# Altium project 遥控器.PrjPcb
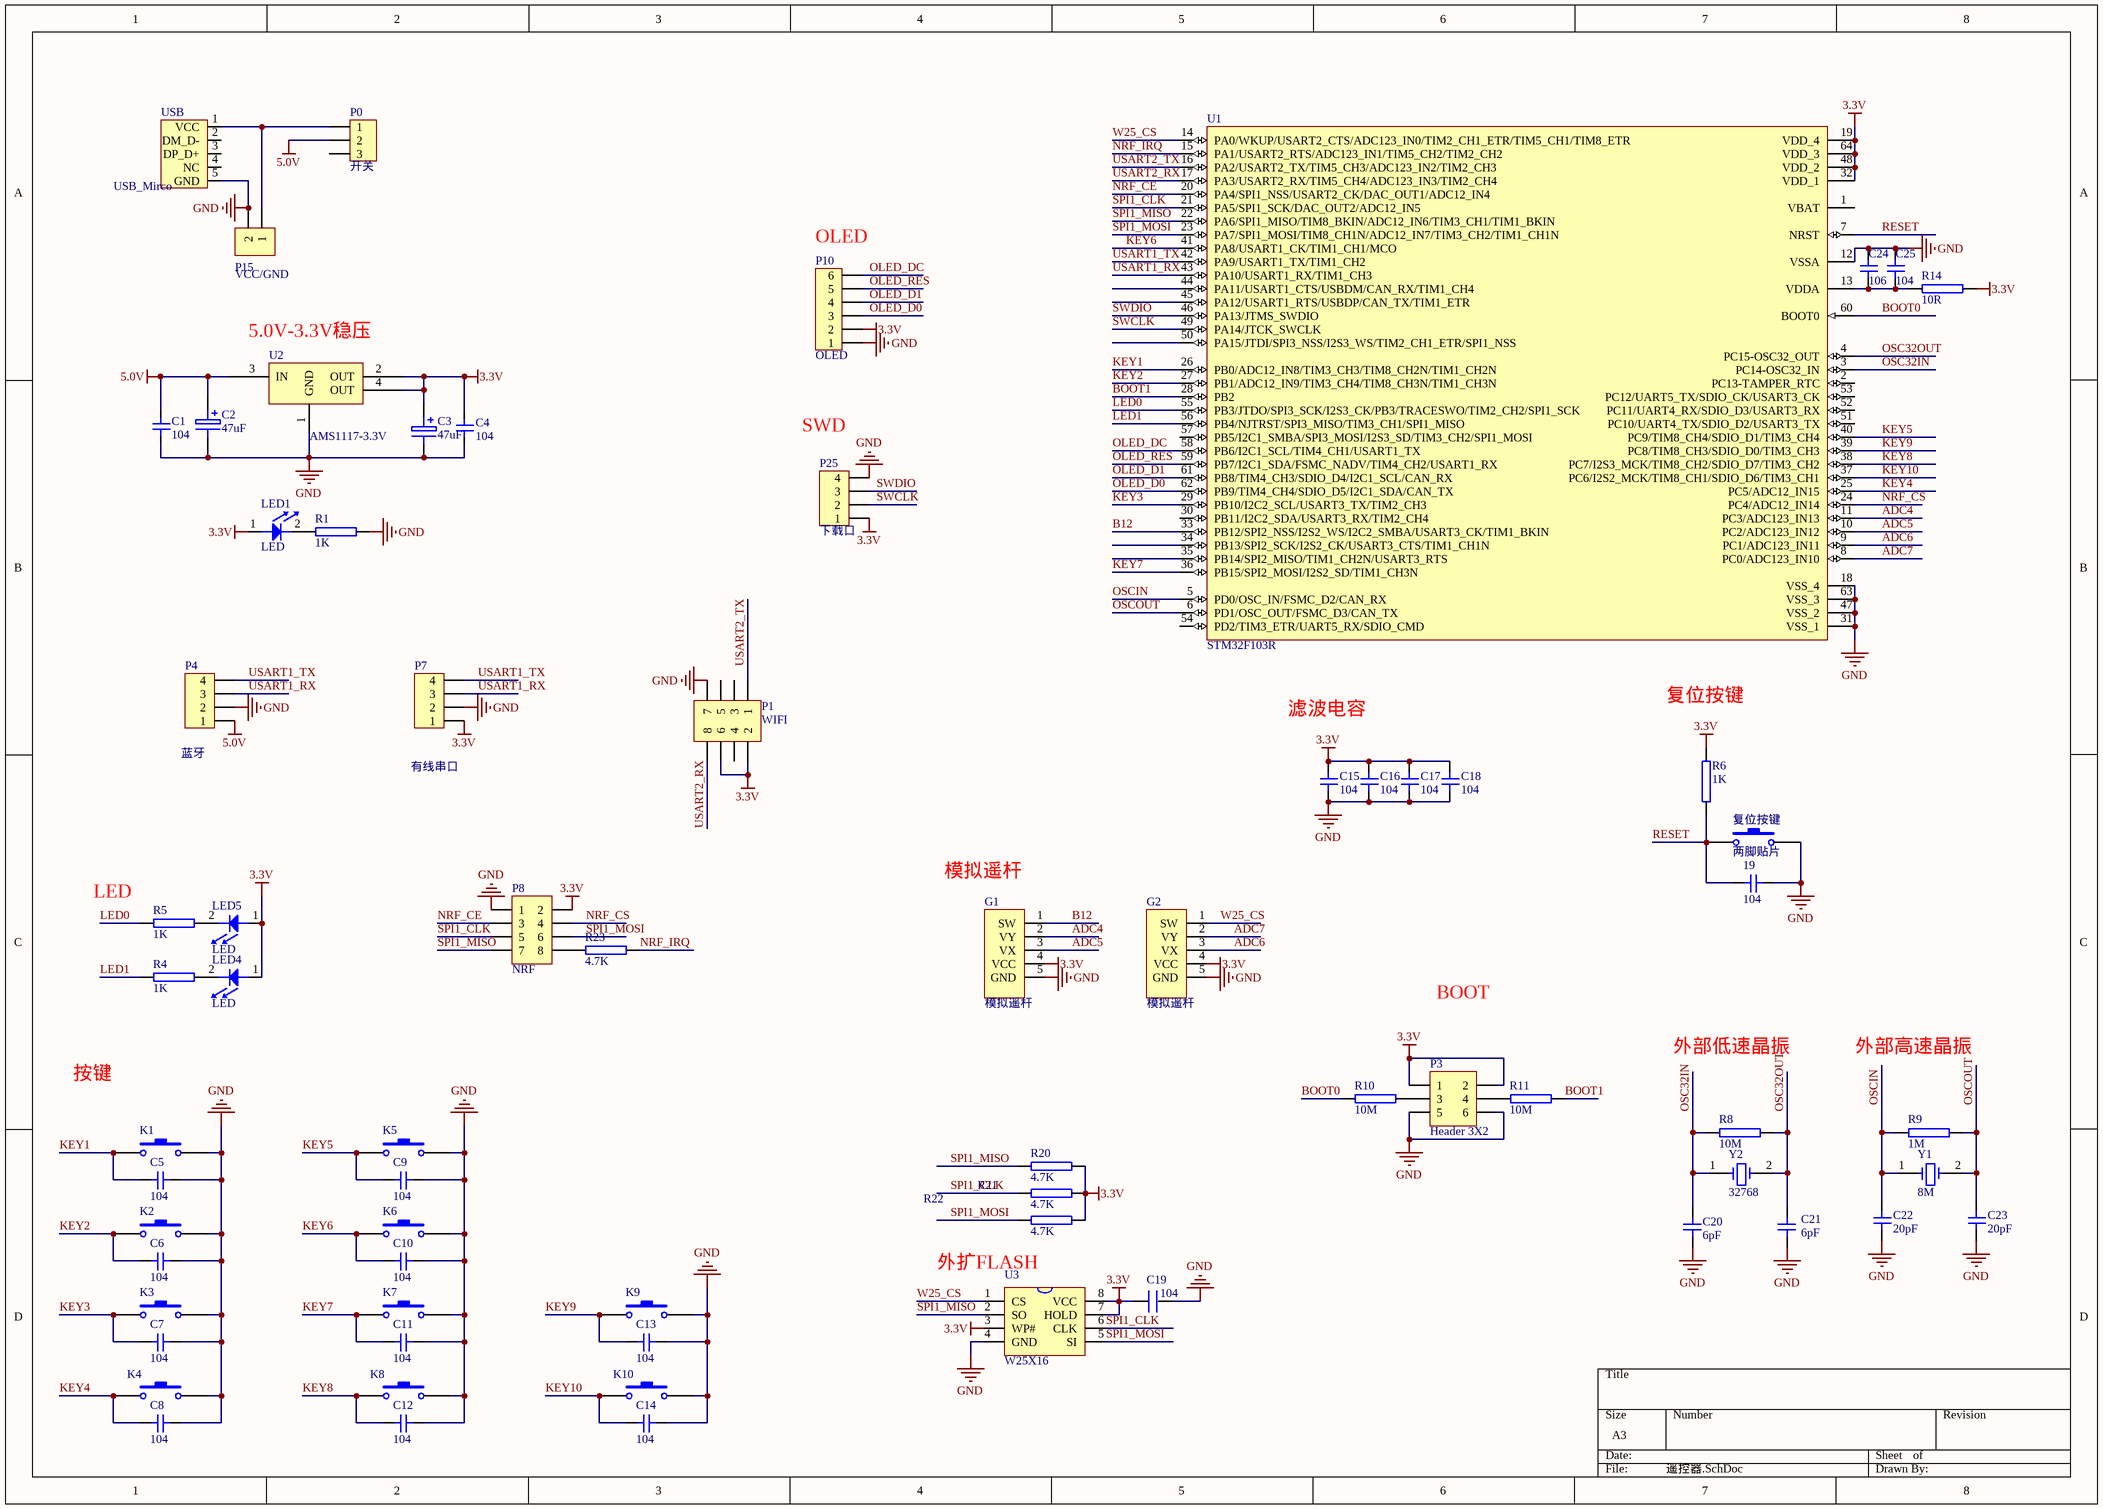
[diagram p0: 遥控器.SchDoc]
1 sheet, 70 parts. Net scope: global (net labels, ports and power ports of the same name join across sheets).
Board file: 遥控器.PcbDoc

## Sheet 遥控器.SchDoc
size A3

### Parts
19  104  [0805C]
C1  104  [0805C]
C2  47uF  [Cap1(47uF)]
C3  47uF  [Cap1(47uF)]
C4  104  [0805C]
C5  104  [0805C]
C6  104  [0805C]
C7  104  [0805C]
C8  104  [0805C]
C9  104  [0805C]
C10  104  [0805C]
C11  104  [0805C]
C12  104  [0805C]
C13  104  [0805C]
C14  104  [0805C]
C15  104  [0603C]
C16  104  [0603C]
C17  104  [0603C]
C18  104  [0603C]
C19  104  [0805C]
C20  6pF  [0603C]
C21  6pF  [0603C]
C22  20pF  [0603C]
C23  20pF  [0603C]
C24  106  [0603C]
C25  104  [0603C]
G1  模拟遥杆  [模拟遥杆(半)]
G2  模拟遥杆  [模拟遥杆(半)]
K1  (no value)  [贴片按键]
K2  (no value)  [贴片按键]
K3  (no value)  [贴片按键]
K4  (no value)  [贴片按键]
K5  (no value)  [贴片按键]
K6  (no value)  [贴片按键]
K7  (no value)  [贴片按键]
K8  (no value)  [贴片按键]
K9  (no value)  [贴片按键]
K10  (no value)  [贴片按键]
LED1  LED  [0805LED]
LED4  LED  [0805LED]
LED5  LED  [0805LED]
P0  开关  [Header 3]
P1  WIFI  [Header 4X2]
P3  Header 3X2  [Header 3X2]
P4  蓝牙  [Header 4]
P7  有线串口  [Header 4]
P8  NRF  [Header 4X2]
P10  OLED  [Header 6]
P15  VCC/GND  [Header 2]
P25  下载口  [Header 4]
R1  1K  [0805R]
R4  1K  [0603R]
R5  1K  [0603R]
R6  1K  [0805R]
R8  10M  [0603R]
R9  1M  [0603R]
R10  10M  [0603R]
R11  10M  [0603R]
R14  10R  [0603R]
R20  4.7K  [0805R]
R21  4.7K  [0805R]
R22  4.7K  [0805R]
R23  4.7K  [0603R]
U1  STM32F103R  [LQFP-64N]
U2  AMS1117-3.3V  [SOT-223]
U3  W25X16  [W25X16]
USB  USB_Mirco  [USB_Micro]
Y1  8M  [22M(晶振)]
Y2  32768  [XTAL]
复位按键  两脚贴片  [贴片按键]

### Nets
3.3V: C3.1 C4.2 C15.2 C16.2 C17.2 C18.2 C19.2 G1.4(VCC) G2.4(VCC) LED1.1 LED4.1 LED5.1 P1.2 P1.6 P3.1 P3.2 P7.1 P8.2 P10.2 P25.1 R6.2 R14.2 R20.2 R21.2 R22.2 U1.19(VDD_4) U1.32(VDD_1) U1.48(VDD_2) U1.64(VDD_3) U2.2(OUT) U2.4(OUT) U3.3(WP#) U3.7(HOLD) U3.8(VCC)
5.0V: C1.2 C2.1 P0.2 P4.1 U2.3(IN)
GND: 19.2 C1.1 C2.2 C3.2 C4.1 C5.2 C6.2 C7.2 C8.2 C9.2 C10.2 C11.2 C12.2 C13.2 C14.2 C15.1 C16.1 C17.1 C18.1 C19.1 C20.2 C21.2 C22.1 C23.1 C24.2 C25.2 G1.5(GND) G2.5(GND) K1.2 K2.2 K3.2 K4.2 K5.2 K6.2 K7.2 K8.2 K9.2 K10.2 P1.7 P3.5 P3.6 P4.2 P7.2 P8.1 P10.1 P15.2 P25.4 R1.1 U1.12(VSSA) U1.18(VSS_4) U1.31(VSS_1) U1.47(VSS_2) U1.63(VSS_3) U2.1(GND) U3.4(GND) USB.5(GND) 复位按键.2
ADC4: G1.2(VY) U1.11(PC3/ADC123_IN13)
ADC5: G1.3(VX) U1.10(PC2/ADC123_IN12)
ADC6: G2.3(VX) U1.9(PC1/ADC123_IN11)
ADC7: G2.2(VY) U1.8(PC0/ADC123_IN10)
B12: G1.1(SW) U1.33(PB12/SPI2_NSS/I2S2_WS/I2C2_SMBA/USART3_CK/TIM1_BKIN)
BOOT0: R10.1 U1.60(BOOT0)
BOOT1: R11.2 U1.28(PB2)
KEY1: C5.1 K1.1 U1.26(PB0/ADC12_IN8/TIM3_CH3/TIM8_CH2N/TIM1_CH2N)
KEY2: C6.1 K2.1 U1.27(PB1/ADC12_IN9/TIM3_CH4/TIM8_CH3N/TIM1_CH3N)
KEY3: C7.1 K3.1 U1.29(PB10/I2C2_SCL/USART3_TX/TIM2_CH3)
KEY4: C8.1 K4.1 U1.25(PC5/ADC12_IN15)
KEY5: C9.1 K5.1 U1.40(PC9/TIM8_CH4/SDIO_D1/TIM3_CH4)
KEY6: C10.1 K6.1 U1.41(PA8/USART1_CK/TIM1_CH1/MCO)
KEY7: C11.1 K7.1 U1.36(PB15/SPI2_MOSI/I2S2_SD/TIM1_CH3N)
KEY8: C12.1 K8.1 U1.38(PC7/I2S3_MCK/TIM8_CH2/SDIO_D7/TIM3_CH2)
KEY9: C13.1 K9.1 U1.39(PC8/TIM8_CH3/SDIO_D0/TIM3_CH3)
KEY10: C14.1 K10.1 U1.37(PC6/I2S2_MCK/TIM8_CH1/SDIO_D6/TIM3_CH1)
LED0: R5.2 U1.55(PB3/JTDO/SPI3_SCK/I2S3_CK/PB3/TRACESWO/TIM2_CH2/SPI1_SCK)
LED1: R4.2 U1.56(PB4/NJTRST/SPI3_MISO/TIM3_CH1/SPI1_MISO)
NRF_CE: P8.3 U1.20(PA4/SPI1_NSS/USART2_CK/DAC_OUT1/ADC12_IN4)
NRF_CS: P8.4 U1.24(PC4/ADC12_IN14)
NRF_IRQ: R23.1 U1.15(PA1/USART2_RTS/ADC123_IN1/TIM5_CH2/TIM2_CH2)
OLED_D0: P10.3 U1.62(PB9/TIM4_CH4/SDIO_D5/I2C1_SDA/CAN_TX)
OLED_D1: P10.4 U1.61(PB8/TIM4_CH3/SDIO_D4/I2C1_SCL/CAN_RX)
OLED_DC: P10.6 U1.58(PB6/I2C1_SCL/TIM4_CH1/USART1_TX)
OLED_RES: P10.5 U1.59(PB7/I2C1_SDA/FSMC_NADV/TIM4_CH2/USART1_RX)
OSC32IN: C20.1 R8.1 U1.3(PC14-OSC32_IN) Y2.1
OSC32OUT: C21.1 R8.2 U1.4(PC15-OSC32_OUT) Y2.2
OSCIN: C22.2 R9.1 U1.5(PD0/OSC_IN/FSMC_D2/CAN_RX) Y1.1
OSCOUT: C23.2 R9.2 U1.6(PD1/OSC_OUT/FSMC_D3/CAN_TX) Y1.2
RESET: 19.1 R6.1 U1.7(NRST) 复位按键.1
SPI1_CLK: P8.5 R21.1 U1.21(PA5/SPI1_SCK/DAC_OUT2/ADC12_IN5) U3.6(CLK)
SPI1_MISO: P8.7 R20.1 U1.22(PA6/SPI1_MISO/TIM8_BKIN/ADC12_IN6/TIM3_CH1/TIM1_BKIN) U3.2(SO)
SPI1_MOSI: P8.6 R22.1 U1.23(PA7/SPI1_MOSI/TIM8_CH1N/ADC12_IN7/TIM3_CH2/TIM1_CH1N) U3.5(SI)
SWCLK: P25.2 U1.49(PA14/JTCK_SWCLK)
SWDIO: P25.3 U1.46(PA13/JTMS_SWDIO)
USART1_RX: P4.3 P7.3 U1.43(PA10/USART1_RX/TIM1_CH3)
USART1_TX: P4.4 P7.4 U1.42(PA9/USART1_TX/TIM1_CH2)
USART2_RX: P1.8 U1.17(PA3/USART2_RX/TIM5_CH4/ADC123_IN3/TIM2_CH4)
USART2_TX: P1.1 U1.16(PA2/USART2_TX/TIM5_CH3/ADC123_IN2/TIM2_CH3)
W25_CS: G2.1(SW) U1.14(PA0/WKUP/USART2_CTS/ADC123_IN0/TIM2_CH1_ETR/TIM5_CH1/TIM8_ETR) U3.1(CS)
NetC24_1: C24.1 C25.1 R14.1 U1.13(VDDA)
NetLED1_2: LED1.2 R1.2
NetLED4_2: LED4.2 R4.1
NetLED5_2: LED5.2 R5.1
NetP0_1: P0.1 P15.1 USB.1(VCC)
NetP3_3: P3.3 R10.2
NetP3_4: P3.4 R11.1
NetP8_8: P8.8 R23.2

Not connected (* = marked no-connect by the designer): P0 3; P1 3 4 5; U1 1(VBAT) 2(PC13-TAMPER_RTC) 30(PB11/I2C2_SDA/USART3_RX/TIM2_CH4) 34(PB13/SPI2_SCK/I2S2_CK/USART3_CTS/TIM1_CH1N) 35(PB14/SPI2_MISO/TIM1_CH2N/USART3_RTS) 44(PA11/USART1_CTS/USBDM/CAN_RX/TIM1_CH4) 45(PA12/USART1_RTS/USBDP/CAN_TX/TIM1_ETR) 50(PA15/JTDI/SPI3_NSS/I2S3_WS/TIM2_CH1_ETR/SPI1_NSS) 51(PC10/UART4_TX/SDIO_D2/USART3_TX) 52(PC11/UART4_RX/SDIO_D3/USART3_RX) 53(PC12/UART5_TX/SDIO_CK/USART3_CK) 54(PD2/TIM3_ETR/UART5_RX/SDIO_CMD) 57(PB5/I2C1_SMBA/SPI3_MOSI/I2S3_SD/TIM3_CH2/SPI1_MOSI); USB 2(DM_D-) 3(DP_D+) 4(NC)

### Notes on the sheet
- (near P10) OLED
- (near U2) 5.0V-3.3V稳压
- (near P25) SWD
- 滤波电容
- 复位按键
- (near R5) LED
- 模拟遥杆
- BOOT
- 外部低速晶振
- 外部高速晶振
- 按键
- 外扩FLASH

### Library data of the parts
19 C1 C4-C18 C20-C25 = C1
C2 C3 = Cap1(100uF)
C19 = C
G1 G2 = 模拟遥感XY
K1-K10 复位按键 = Key(两脚贴片)
P0 = Header 3
P1 P8 = Header 4X2
P4 P7 P25 = Header 4
P10 = Header 6
P15 = Header 2
R1 R4-R6 R8-R11 R14 R20-R23 = R1
U2 = AMS1117-3.3V/5.0V
USB = USB_Micro
Y1 Y2 = XTAL